# EasyEDA schematic Detector.json
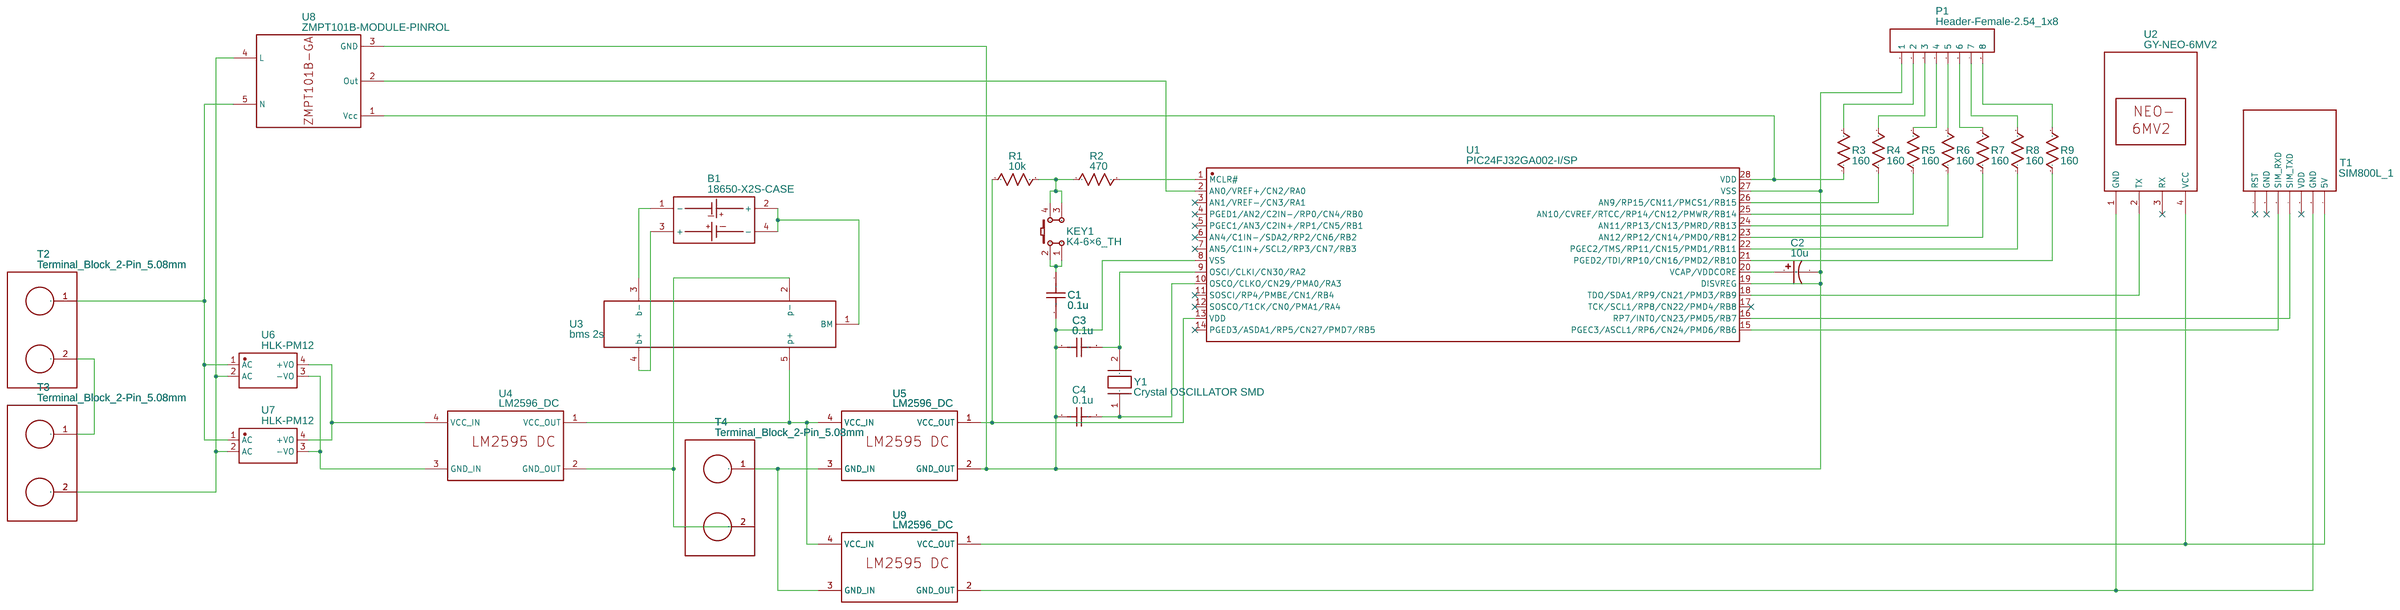
[diagram p0: schematic sheet]

## Parts
B1  18650-X2S-CASE  [18650-X2S]
C1  0.1u  [CAP-D5.0XF2.0]
C2  10u  [CAP-D5.0XF2.0]
C3  0.1u  [CERAMIC-2.54]
C4  0.1u  [CERAMIC-2.54]
KEY1  K4-6×6_TH  [KEY-TH_4P-L6.0-W6.0-P4.50-LS6.5]
P1  Header-Female-2.54_1x8  [HDR-TH_8P-P2.54-V-F-1]
R1  10k  [RC05]
R2  470  [RC05]
R3  160  [RC05]
R4  160  [RC05]
R5  160  [RC05]
R6  160  [RC05]
R7  160  [RC05]
R8  160  [RC05]
R9  160  [RC05]
T1  SIM800L_1  [SIM800L]
T2  Terminal_Block_2-Pin_5.08mm  [TERMINAL_BLOCK_2-PIN_5.08]
T3  Terminal_Block_2-Pin_5.08mm  [TERMINAL_BLOCK_2-PIN_5.08]
T4  Terminal_Block_2-Pin_5.08mm  [TERMINAL_BLOCK_2-PIN_5.08]
U1  PIC24FJ32GA002-I/SP  [SPDIP-28_L34.7-W7.2-P2.54-LS7.9-BL]
U2  GY-NEO-6MV2  [GY-NEO6MV2]
U3  bms 2s  [BMS 2S]
U4  LM2596_DC  [LM2596_DC]
U5  LM2596_DC  [LM2596_DC]
U6  HLK-PM12  [PWRM-TH_HLK-PM12]
U7  HLK-PM12  [PWRM-TH_HLK-PM12]
U8  ZMPT101B-MODULE-PINROL  [ZMPT101B-MODULE]
U9  LM2596_DC  [LM2596_DC]
Y1  Crystal OSCILLATOR SMD  [CRYSTAL-TH_L11.1-W4.7]

## Library data of the parts
B1 = 18650-X2S-CASE: Contributor: Александр Концевой
C1 C3 C4 = C_0603_US: Contributor: LCEDA_Lib
C2 = C_Tan_SMD_A_US: Contributor: LCEDA_Lib
KEY1 = K4-6×6_TH: Supplier: LCSC; Supplier Part: C136684; Manufacturer: 韩国韩荣; Manufacturer Part: K2-1102DP-E4SW-04; Contributor: LCEDA_Lib
P1 = Header-Female-2.54_1x8: Supplier: LCSC; Manufacturer: BOOMELE; Manufacturer Part: Female headerHDR1X8-2.54; Supplier Part: C27438; JLCPCB Part Class: Extended Part
R1-R9 = R_0603_US: Contributor: LCEDA_Lib
T1 = SIM800L_1: sourceId: Cf9Flf9rJ
T2-T4 = Terminal_Block_2-Pin_5.08mm: Manufacturer: Excellway; Supplier Part: DR55-8-Pin-5.08mm; Contributor: kenschellenberg
U1 = PIC24FJ32GA002-I/SP: Supplier: LCSC; Supplier Part: C643615; Manufacturer: Microchip Tech; Contributor: LCSC; JLCPCB Part Class: Extended Part
U2 = GY-NEO-6MV2: Supplier: Amazon; Contributor: Ulf Modig
U3 = bms 2s: Contributor: Impostory
U4 U5 U9 = LM2596_DC: Manufacturer Part: LM2596 DC 5V; Contributor: anton.starshinov
U6 U7 = HLK-PM12: Supplier: LCSC; Supplier Part: C209905; Manufacturer: HI-LINK; Contributor: LCSC; JLCPCB Part Class: Extended Part
U8 = ZMPT101B-MODULE-PINROL: Supplier: Boudbrousse; Contributor: boudbrousse
Y1 = Crystal OSCILLATOR SMD: Manufacturer Part: ABLS-4.000MHz-B2; Contributor: victorbramhall; Supplier Part: 703-1777; Supplier: Mouser; link: https://uk.rs-online.com/web/p/crystal-units/7031777/

## Nets
Net-(B1-1): B1.1(-) U3.3(b-)
Net-(B1-2): B1.2(+) B1.4(-) U3.1(BM)
Net-(B1-3): B1.3(+) U3.4(b+)
Net-(C1-1): C1.1 KEY1.1 KEY1.2
Net-(C1-2): C1.2 C2.2 C3.1 C4.1 P1.1 U1.8(VSS) U1.19(DISVREG) U1.27(VSS) U5.2(GND_OUT) U8.3(GND)
Net-(C2-1): C2.1 U1.20(VCAP/VDDCORE)
Net-(C3-2): C3.2 U1.9(OSCI/CLKI/CN30/RA2) Y1.2
Net-(C4-2): C4.2 U1.10(OSCO/CLKO/CN29/PMA0/RA3) Y1.1
Net-(KEY1-3): KEY1.3 KEY1.4 R1.2 R2.1
Net-(P1-2): P1.2 R3.2
Net-(P1-3): P1.3 R4.2
Net-(P1-4): P1.4 R5.2
Net-(P1-5): P1.5 R6.2
Net-(P1-6): P1.6 R7.2
Net-(P1-7): P1.7 R8.2
Net-(P1-8): P1.8 R9.2
Net-(R1-1): R1.1 U1.13(VDD) U5.1(VCC_OUT)
Net-(R2-2): R2.2 U1.1(MCLR#)
Net-(R3-1): R3.1 U1.28(VDD) U8.1(Vcc)
Net-(R4-1): R4.1 U1.26(AN9/RP15/CN11/PMCS1/RB15)
Net-(R5-1): R5.1 U1.25(AN10/CVREF/RTCC/RP14/CN12/PMWR/RB14)
Net-(R6-1): R6.1 U1.24(AN11/RP13/CN13/PMRD/RB13)
Net-(R7-1): R7.1 U1.23(AN12/RP12/CN14/PMD0/RB12)
Net-(R8-1): R8.1 U1.22(PGEC2/TMS/RP11/CN15/PMD1/RB11)
Net-(R9-1): R9.1 U1.21(PGED2/TDI/RP10/CN16/PMD2/RB10)
Net-(T1-3): T1.3(SIM_RXD) U1.15(PGEC3/ASCL1/RP6/CN24/PMD6/RB6)
Net-(T1-4): T1.4(SIM_TXD) U1.16(RP7/INT0/CN23/PMD5/RB7)
Net-(T1-6): T1.6(GND) U2.1(GND) U9.2(GND_OUT)
Net-(T1-7): T1.7(5V) U2.4(VCC) U9.1(VCC_OUT)
Net-(T2-1): T2.1 U6.1(AC) U7.1(AC) U8.5(N)
Net-(T2-2): T2.2 T3.1
Net-(T3-2): T3.2 U6.2(AC) U7.2(AC) U8.4(L)
Net-(T4-1): T4.1 U5.3(GND_IN) U9.3(GND_IN)
Net-(T4-2): T4.2 U3.2(p-) U4.2(GND_OUT)
Net-(U1-2): U1.2(AN0/VREF+/CN2/RA0) U8.2(Out)
Net-(U1-18): U1.18(TDO/SDA1/RP9/CN21/PMD3/RB9) U2.2(TX)
Net-(U3-5): U3.5(p+) U4.1(VCC_OUT) U5.4(VCC_IN) U9.4(VCC_IN)
Net-(U4-3): U4.3(GND_IN) U6.3(-VO) U7.3(-VO)
Net-(U4-4): U4.4(VCC_IN) U6.4(+VO) U7.4(+VO)

Not connected (* = marked no-connect by the designer): T1 1(RST)* 2(GND)* 5(VDD)*; U1 3(AN1/VREF-/CN3/RA1)* 4(PGED1/AN2/C2IN-/RP0/CN4/RB0)* 5(PGEC1/AN3/C2IN+/RP1/CN5/RB1)* 6(AN4/C1IN-/SDA2/RP2/CN6/RB2)* 7(AN5/C1IN+/SCL2/RP3/CN7/RB3)* 11(SOSCI/RP4/PMBE/CN1/RB4)* 12(SOSCO/T1CK/CN0/PMA1/RA4)* 14(PGED3/ASDA1/RP5/CN27/PMD7/RB5)* 17(TCK/SCL1/RP8/CN22/PMD4/RB8)*; U2 3(RX)*
